# Altium project PCB_Project1.PrjPCB
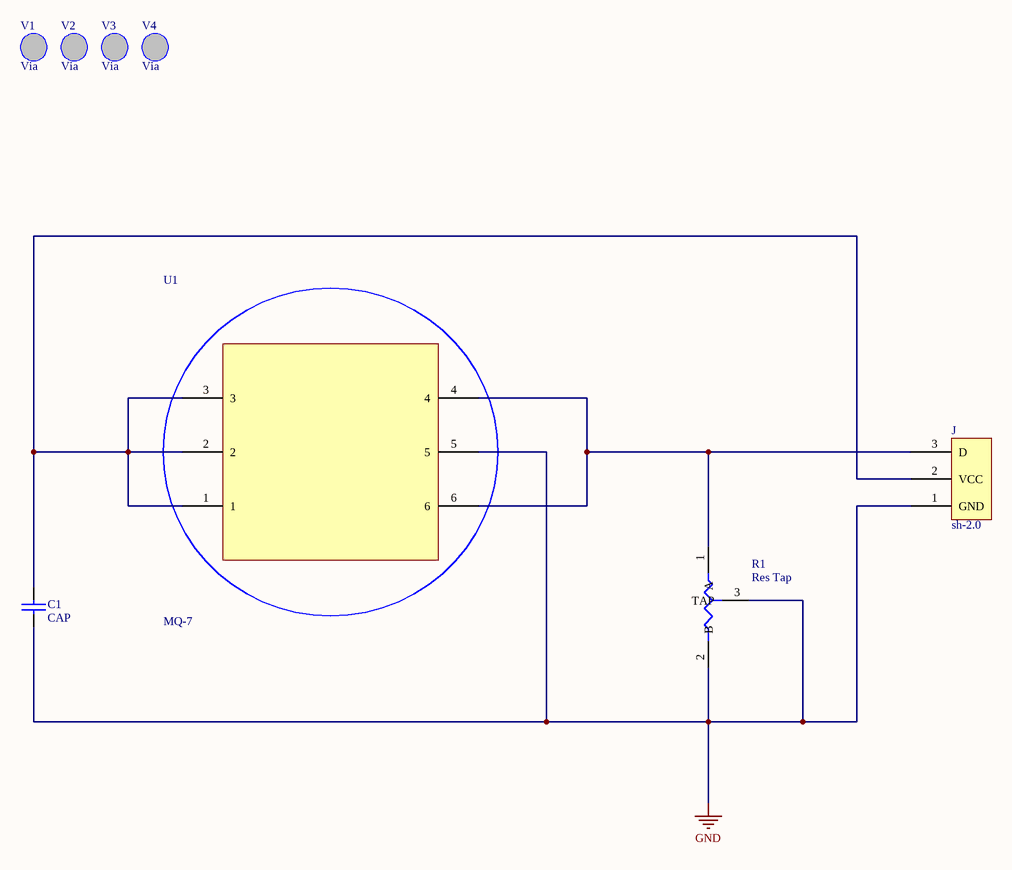
[diagram p0: Sheet1.SchDoc]
1 sheet, 8 parts. Net scope: global (net labels, ports and power ports of the same name join across sheets).
Board file: PCB1.PcbDoc

## Sheet Sheet1.SchDoc
size A4

### Parts
C1  CAP  [1608[0603]]
J  sh-2.0  [sh-2.0]
R1  Res Tap  [BORUNS_3314J-1]
U1  MQ-7  [MQ-7]
V1  Via  [Via]
V2  Via  [Via]
V3  Via  [Via]
V4  Via  [Via]

### Nets
GND: C1.2 J.1(GND) R1.2(B) R1.3(TAP) U1.5
NetC1_1: C1.1 J.2(VCC) U1.1 U1.2 U1.3
NetJ_3: J.3(D) R1.1(A) U1.4 U1.6

### Library data of the parts
J = sh-2.0: pin to pad: 1>3 3>1